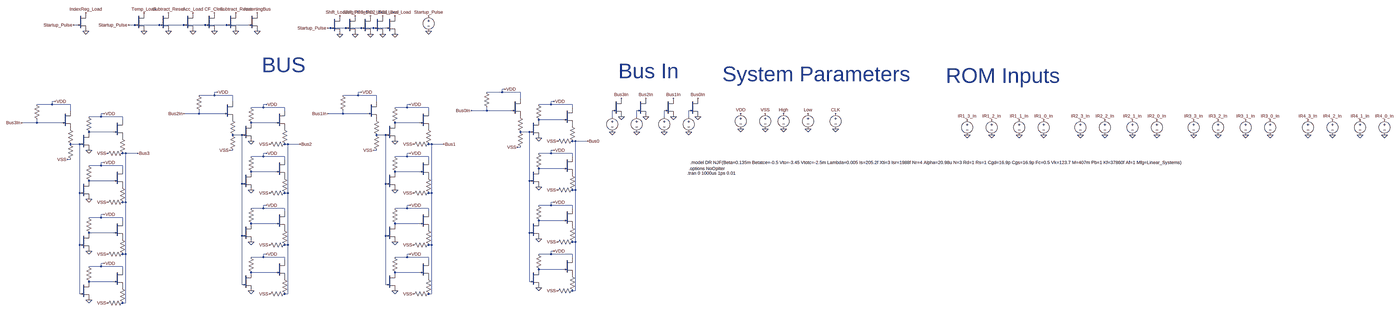
[diagram p0: schematic controls.asc, whole sheet]
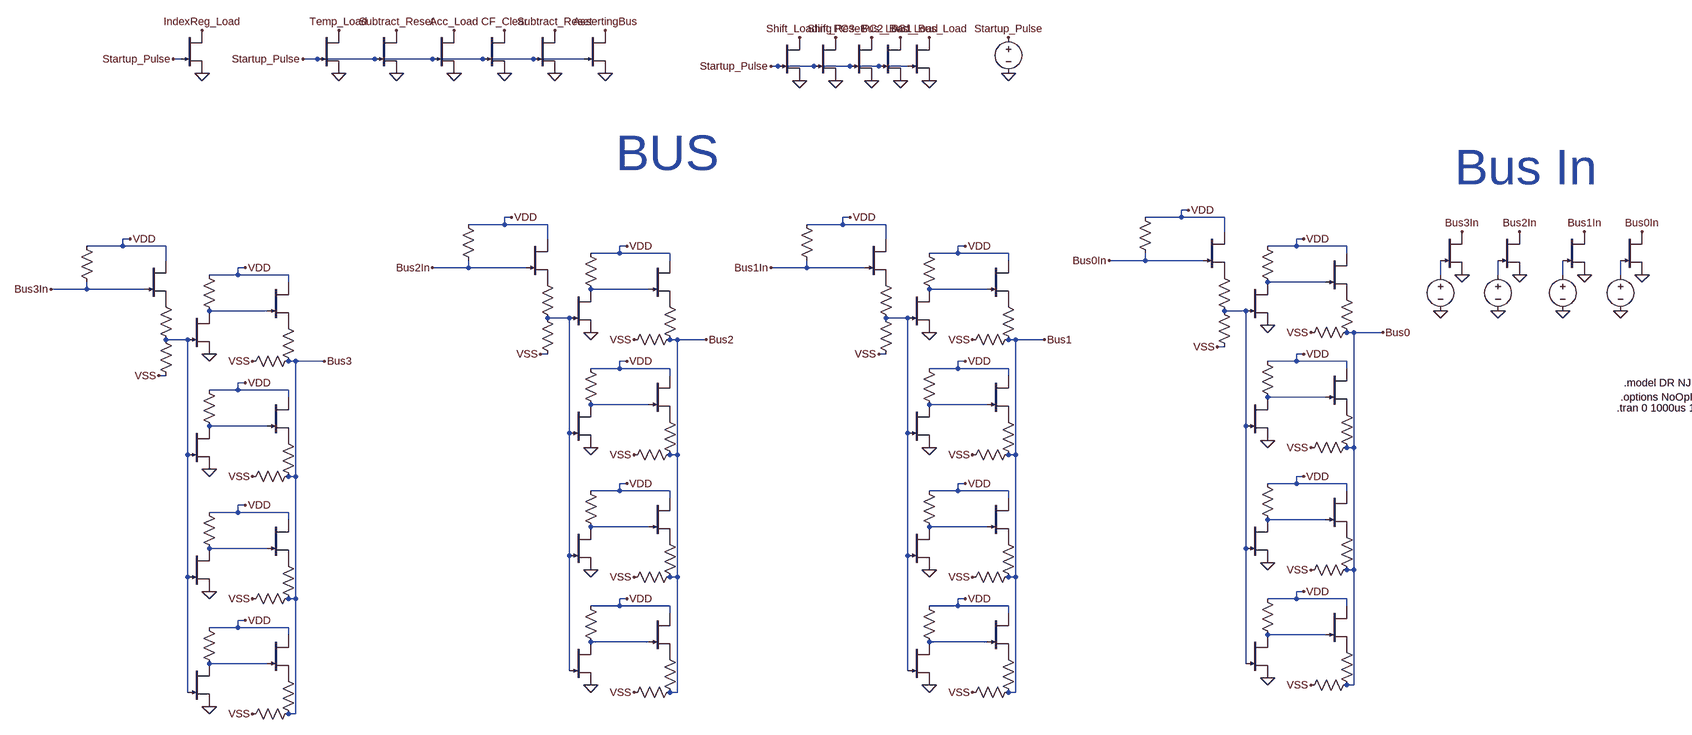
[diagram p1: schematic controls.asc, part, row 1 of 1, column 1 of 2]
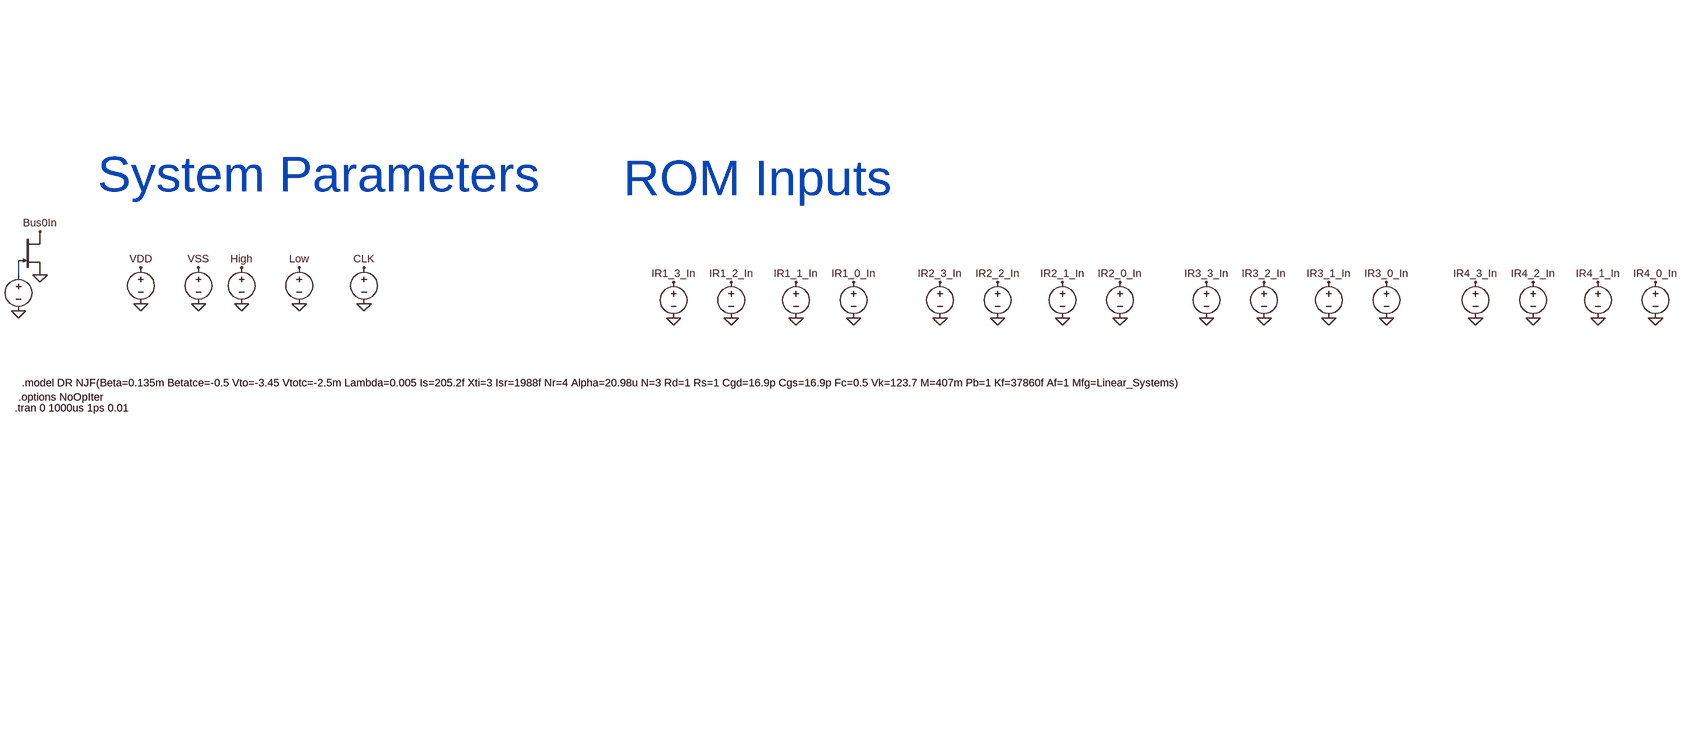
[diagram p2: schematic controls.asc, part, row 1 of 1, column 2 of 2]
controls.asc, the LTspice schematic file:
Version 4.1
SHEET 1 109444 42780
WIRE 5360 -10224 5344 -10224
WIRE 5664 -10224 5632 -10224
WIRE 5792 -10224 5664 -10224
WIRE 5920 -10224 5792 -10224
WIRE 6032 -10224 5920 -10224
WIRE 6144 -10224 6032 -10224
WIRE 6256 -10224 6144 -10224
WIRE 6688 -10208 6672 -10208
WIRE 6768 -10208 6688 -10208
WIRE 6848 -10208 6768 -10208
WIRE 6912 -10208 6848 -10208
WIRE 6976 -10208 6912 -10208
WIRE 7600 -9888 7584 -9888
WIRE 6096 -9872 6080 -9872
WIRE 6848 -9872 6832 -9872
WIRE 7584 -9872 7584 -9888
WIRE 7584 -9872 7504 -9872
WIRE 7680 -9872 7584 -9872
WIRE 6080 -9856 6080 -9872
WIRE 6080 -9856 6000 -9856
WIRE 6176 -9856 6080 -9856
WIRE 6832 -9856 6832 -9872
WIRE 6832 -9856 6752 -9856
WIRE 6928 -9856 6832 -9856
WIRE 7680 -9840 7680 -9872
WIRE 5248 -9824 5232 -9824
WIRE 6176 -9824 6176 -9856
WIRE 6928 -9824 6928 -9856
WIRE 7856 -9824 7840 -9824
WIRE 5232 -9808 5232 -9824
WIRE 5232 -9808 5152 -9808
WIRE 5328 -9808 5232 -9808
WIRE 6352 -9808 6336 -9808
WIRE 7104 -9808 7088 -9808
WIRE 7840 -9808 7840 -9824
WIRE 7840 -9808 7776 -9808
WIRE 7952 -9808 7840 -9808
WIRE 6336 -9792 6336 -9808
WIRE 6336 -9792 6272 -9792
WIRE 6448 -9792 6336 -9792
WIRE 7088 -9792 7088 -9808
WIRE 7088 -9792 7024 -9792
WIRE 7200 -9792 7088 -9792
WIRE 7952 -9792 7952 -9808
WIRE 5328 -9776 5328 -9808
WIRE 6448 -9776 6448 -9792
WIRE 7200 -9776 7200 -9792
WIRE 7504 -9776 7504 -9792
WIRE 7504 -9776 7424 -9776
WIRE 7632 -9776 7504 -9776
WIRE 5504 -9760 5488 -9760
WIRE 6000 -9760 6000 -9776
WIRE 6000 -9760 5920 -9760
WIRE 6128 -9760 6000 -9760
WIRE 6752 -9760 6752 -9776
WIRE 6752 -9760 6672 -9760
WIRE 6880 -9760 6752 -9760
WIRE 5488 -9744 5488 -9760
WIRE 5488 -9744 5424 -9744
WIRE 5600 -9744 5488 -9744
WIRE 8160 -9744 8160 -9776
WIRE 8288 -9744 8288 -9776
WIRE 8432 -9744 8432 -9776
WIRE 8560 -9744 8560 -9776
WIRE 5600 -9728 5600 -9744
WIRE 7904 -9728 7776 -9728
WIRE 5152 -9712 5152 -9728
WIRE 5152 -9712 5072 -9712
WIRE 5280 -9712 5152 -9712
WIRE 6400 -9712 6272 -9712
WIRE 7152 -9712 7024 -9712
WIRE 5552 -9664 5424 -9664
WIRE 7728 -9664 7680 -9664
WIRE 6224 -9648 6176 -9648
WIRE 6976 -9648 6928 -9648
WIRE 7968 -9616 7952 -9616
WIRE 8032 -9616 7968 -9616
WIRE 5376 -9600 5328 -9600
WIRE 6464 -9600 6448 -9600
WIRE 6528 -9600 6464 -9600
WIRE 7216 -9600 7200 -9600
WIRE 7280 -9600 7216 -9600
WIRE 7680 -9584 7664 -9584
WIRE 6176 -9568 6160 -9568
WIRE 6928 -9568 6912 -9568
WIRE 7856 -9568 7840 -9568
WIRE 5616 -9552 5600 -9552
WIRE 5680 -9552 5616 -9552
WIRE 6352 -9552 6336 -9552
WIRE 7104 -9552 7088 -9552
WIRE 7840 -9552 7840 -9568
WIRE 7840 -9552 7776 -9552
WIRE 7952 -9552 7840 -9552
WIRE 6336 -9536 6336 -9552
WIRE 6336 -9536 6272 -9536
WIRE 6448 -9536 6336 -9536
WIRE 7088 -9536 7088 -9552
WIRE 7088 -9536 7024 -9536
WIRE 7200 -9536 7088 -9536
WIRE 7952 -9536 7952 -9552
WIRE 5328 -9520 5312 -9520
WIRE 6448 -9520 6448 -9536
WIRE 7200 -9520 7200 -9536
WIRE 5504 -9504 5488 -9504
WIRE 5488 -9488 5488 -9504
WIRE 5488 -9488 5424 -9488
WIRE 5600 -9488 5488 -9488
WIRE 5600 -9472 5600 -9488
WIRE 7904 -9472 7776 -9472
WIRE 6400 -9456 6272 -9456
WIRE 7152 -9456 7024 -9456
WIRE 5552 -9408 5424 -9408
WIRE 7728 -9408 7728 -9664
WIRE 6224 -9392 6224 -9648
WIRE 6976 -9392 6976 -9648
WIRE 7968 -9360 7968 -9616
WIRE 7968 -9360 7952 -9360
WIRE 5376 -9344 5376 -9600
WIRE 6464 -9344 6464 -9600
WIRE 6464 -9344 6448 -9344
WIRE 7216 -9344 7216 -9600
WIRE 7216 -9344 7200 -9344
WIRE 5616 -9296 5616 -9552
WIRE 5616 -9296 5600 -9296
WIRE 7856 -9296 7840 -9296
WIRE 6352 -9280 6336 -9280
WIRE 7104 -9280 7088 -9280
WIRE 7840 -9280 7840 -9296
WIRE 7840 -9280 7776 -9280
WIRE 7952 -9280 7840 -9280
WIRE 6336 -9264 6336 -9280
WIRE 6336 -9264 6272 -9264
WIRE 6448 -9264 6336 -9264
WIRE 7088 -9264 7088 -9280
WIRE 7088 -9264 7024 -9264
WIRE 7200 -9264 7088 -9264
WIRE 7952 -9264 7952 -9280
WIRE 6448 -9248 6448 -9264
WIRE 7200 -9248 7200 -9264
WIRE 5504 -9232 5488 -9232
WIRE 5488 -9216 5488 -9232
WIRE 5488 -9216 5424 -9216
WIRE 5600 -9216 5488 -9216
WIRE 5600 -9200 5600 -9216
WIRE 7904 -9200 7776 -9200
WIRE 6400 -9184 6272 -9184
WIRE 7152 -9184 7024 -9184
WIRE 5552 -9136 5424 -9136
WIRE 7728 -9136 7728 -9408
WIRE 6224 -9120 6224 -9392
WIRE 6976 -9120 6976 -9392
WIRE 7968 -9088 7968 -9360
WIRE 7968 -9088 7952 -9088
WIRE 5376 -9072 5376 -9344
WIRE 6464 -9072 6464 -9344
WIRE 6464 -9072 6448 -9072
WIRE 7216 -9072 7216 -9344
WIRE 7216 -9072 7200 -9072
WIRE 7856 -9040 7840 -9040
WIRE 5616 -9024 5616 -9296
WIRE 5616 -9024 5600 -9024
WIRE 6352 -9024 6336 -9024
WIRE 7104 -9024 7088 -9024
WIRE 7840 -9024 7840 -9040
WIRE 7840 -9024 7776 -9024
WIRE 7952 -9024 7840 -9024
WIRE 6336 -9008 6336 -9024
WIRE 6336 -9008 6272 -9008
WIRE 6448 -9008 6336 -9008
WIRE 7088 -9008 7088 -9024
WIRE 7088 -9008 7024 -9008
WIRE 7200 -9008 7088 -9008
WIRE 7952 -9008 7952 -9024
WIRE 6448 -8992 6448 -9008
WIRE 7200 -8992 7200 -9008
WIRE 5504 -8976 5488 -8976
WIRE 5488 -8960 5488 -8976
WIRE 5488 -8960 5424 -8960
WIRE 5600 -8960 5488 -8960
WIRE 5600 -8944 5600 -8960
WIRE 7904 -8944 7776 -8944
WIRE 6400 -8928 6272 -8928
WIRE 7152 -8928 7024 -8928
WIRE 5552 -8880 5424 -8880
WIRE 7728 -8880 7728 -9136
WIRE 6224 -8864 6224 -9120
WIRE 6976 -8864 6976 -9120
WIRE 7968 -8832 7968 -9088
WIRE 7968 -8832 7952 -8832
WIRE 5376 -8816 5376 -9072
WIRE 6464 -8816 6464 -9072
WIRE 6464 -8816 6448 -8816
WIRE 7216 -8816 7216 -9072
WIRE 7216 -8816 7200 -8816
WIRE 5616 -8768 5616 -9024
WIRE 5616 -8768 5600 -8768
FLAG 8960 -9680 0
FLAG 8832 -9760 VDD
FLAG 8832 -9680 0
FLAG 8960 -9760 VSS
FLAG 9056 -9680 0
FLAG 9056 -9760 High
FLAG 9184 -9680 0
FLAG 9184 -9760 Low
FLAG 9328 -9680 0
FLAG 9328 -9760 CLK
FLAG 10016 -9648 0
FLAG 10144 -9648 0
FLAG 10288 -9648 0
FLAG 10416 -9648 0
FLAG 6528 -9600 Bus2
FLAG 7280 -9600 Bus1
FLAG 8032 -9616 Bus0
FLAG 5920 -9760 Bus2In
FLAG 6672 -9760 Bus1In
FLAG 7424 -9776 Bus0In
FLAG 10016 -9728 IR1_3_In
FLAG 10144 -9728 IR1_2_In
FLAG 10288 -9728 IR1_1_In
FLAG 10416 -9728 IR1_0_In
FLAG 10608 -9648 0
FLAG 10736 -9648 0
FLAG 10880 -9648 0
FLAG 11008 -9648 0
FLAG 10608 -9728 IR2_3_In
FLAG 10736 -9728 IR2_2_In
FLAG 10880 -9728 IR2_1_In
FLAG 11008 -9728 IR2_0_In
FLAG 11200 -9648 0
FLAG 11328 -9648 0
FLAG 11472 -9648 0
FLAG 11600 -9648 0
FLAG 11200 -9728 IR3_3_In
FLAG 11328 -9728 IR3_2_In
FLAG 11472 -9728 IR3_1_In
FLAG 11600 -9728 IR3_0_In
FLAG 11808 -9648 0
FLAG 11936 -9648 0
FLAG 12080 -9648 0
FLAG 12208 -9648 0
FLAG 11808 -9728 IR4_3_In
FLAG 11936 -9728 IR4_2_In
FLAG 12080 -9728 IR4_1_In
FLAG 12208 -9728 IR4_0_In
FLAG 5632 -10224 Startup_Pulse
FLAG 5712 -10288 Temp_Load
FLAG 5968 -10288 Acc_Load
FLAG 6080 -10288 CF_Clear
FLAG 5840 -10288 Subtract_Reset
FLAG 5968 -10192 0
FLAG 5712 -10192 0
FLAG 6080 -10192 0
FLAG 5840 -10192 0
FLAG 6192 -10288 Subtract_Reset
FLAG 6192 -10192 0
FLAG 6304 -10288 AssertingBus
FLAG 6304 -10192 0
FLAG 6672 -10208 Startup_Pulse
FLAG 6736 -10176 0
FLAG 6736 -10272 Shift_Loading
FLAG 6816 -10176 0
FLAG 6816 -10272 Shift_Reset
FLAG 5408 -10288 IndexReg_Load
FLAG 5344 -10224 Startup_Pulse
FLAG 5408 -10192 0
FLAG 7024 -10272 PC1_Bus_Load
FLAG 6960 -10272 PC2_Bus_Load
FLAG 6896 -10272 PC3_Bus_Load
FLAG 6896 -10176 0
FLAG 6960 -10176 0
FLAG 7024 -10176 0
FLAG 7200 -10272 Startup_Pulse
FLAG 7200 -10192 0
FLAG 8160 -9664 0
FLAG 8288 -9664 0
FLAG 8432 -9664 0
FLAG 8560 -9664 0
FLAG 8608 -9840 Bus0In
FLAG 8208 -9744 0
FLAG 8336 -9744 0
FLAG 8480 -9744 0
FLAG 8608 -9744 0
FLAG 8480 -9840 Bus1In
FLAG 8336 -9840 Bus2In
FLAG 8208 -9840 Bus3In
FLAG 5424 -9568 0
FLAG 5248 -9824 VDD
FLAG 5504 -9760 VDD
FLAG 5312 -9520 VSS
FLAG 5520 -9552 VSS
FLAG 5680 -9552 Bus3
FLAG 5072 -9712 Bus3In
FLAG 5424 -9312 0
FLAG 5504 -9504 VDD
FLAG 5520 -9296 VSS
FLAG 5424 -9040 0
FLAG 5504 -9232 VDD
FLAG 5520 -9024 VSS
FLAG 5424 -8784 0
FLAG 5504 -8976 VDD
FLAG 5520 -8768 VSS
FLAG 6272 -9616 0
FLAG 6096 -9872 VDD
FLAG 6352 -9808 VDD
FLAG 6160 -9568 VSS
FLAG 6368 -9600 VSS
FLAG 6272 -9360 0
FLAG 6352 -9552 VDD
FLAG 6368 -9344 VSS
FLAG 6272 -9088 0
FLAG 6352 -9280 VDD
FLAG 6368 -9072 VSS
FLAG 6272 -8832 0
FLAG 6352 -9024 VDD
FLAG 6368 -8816 VSS
FLAG 7024 -9616 0
FLAG 6848 -9872 VDD
FLAG 7104 -9808 VDD
FLAG 6912 -9568 VSS
FLAG 7120 -9600 VSS
FLAG 7024 -9360 0
FLAG 7104 -9552 VDD
FLAG 7120 -9344 VSS
FLAG 7024 -9088 0
FLAG 7104 -9280 VDD
FLAG 7120 -9072 VSS
FLAG 7024 -8832 0
FLAG 7104 -9024 VDD
FLAG 7120 -8816 VSS
FLAG 7776 -9632 0
FLAG 7600 -9888 VDD
FLAG 7856 -9824 VDD
FLAG 7664 -9584 VSS
FLAG 7872 -9616 VSS
FLAG 7776 -9376 0
FLAG 7856 -9568 VDD
FLAG 7872 -9360 VSS
FLAG 7776 -9104 0
FLAG 7856 -9296 VDD
FLAG 7872 -9088 VSS
FLAG 7776 -8848 0
FLAG 7856 -9040 VDD
FLAG 7872 -8832 VSS
SYMBOL voltage 8832 -9776 R0
WINDOW 0 48 34 Invisible 2
WINDOW 3 53 69 Invisible 2
WINDOW 123 0 0 Left 0
WINDOW 39 0 0 Left 0
SYMATTR InstName V4
SYMATTR Value 24
SYMBOL voltage 8960 -9776 R0
WINDOW 123 0 0 Left 0
WINDOW 39 0 0 Left 0
WINDOW 0 37 46 Invisible 2
WINDOW 3 43 75 Invisible 2
SYMATTR InstName V5
SYMATTR Value -20
SYMBOL voltage 9056 -9776 R0
WINDOW 123 0 0 Left 0
WINDOW 39 0 0 Left 0
WINDOW 0 39 38 Invisible 2
WINDOW 3 43 75 Invisible 2
SYMATTR InstName V7
SYMATTR Value PULSE(-3.6 -800m 11u 1ns 1ns 50 50 1)
SYMBOL voltage 9184 -9776 R0
WINDOW 3 24 96 Invisible 2
WINDOW 123 0 0 Left 0
WINDOW 39 0 0 Left 0
WINDOW 0 24 16 Invisible 2
SYMATTR Value PULSE(-800m -3.6 0 1n 1n 50 50 1)
SYMATTR InstName V10
SYMBOL voltage 9328 -9776 R0
WINDOW 123 0 0 Left 0
WINDOW 39 0 0 Left 0
WINDOW 0 39 38 Invisible 2
WINDOW 3 43 75 Invisible 2
SYMATTR InstName V3
SYMATTR Value PULSE(-3.6 -800m 10u 1ns 1ns 5us 10us 10000000000000)
SYMBOL voltage 10016 -9744 R0
WINDOW 0 56 32 Invisible 2
WINDOW 3 56 72 Invisible 2
SYMATTR InstName V_D1
SYMATTR Value PWL file=ir1_3_in.pwl
SYMBOL voltage 10144 -9744 R0
WINDOW 0 56 32 Invisible 2
WINDOW 3 56 72 Invisible 2
WINDOW 123 0 0 Left 0
WINDOW 39 0 0 Left 0
SYMATTR InstName V_D5
SYMATTR Value PWL file=ir1_2_in.pwl
SYMBOL voltage 10288 -9744 R0
WINDOW 0 56 32 Invisible 2
WINDOW 3 56 72 Invisible 2
WINDOW 123 0 0 Left 0
WINDOW 39 0 0 Left 0
SYMATTR InstName V_D2
SYMATTR Value PWL file=ir1_1_in.pwl
SYMBOL voltage 10416 -9744 R0
WINDOW 0 56 32 Invisible 2
WINDOW 3 56 72 Invisible 2
WINDOW 123 0 0 Left 0
WINDOW 39 0 0 Left 0
SYMATTR InstName V_D6
SYMATTR Value PWL file=ir1_0_in.pwl
SYMBOL voltage 10608 -9744 R0
WINDOW 0 56 32 Invisible 2
WINDOW 3 56 72 Invisible 2
SYMATTR InstName V_D3
SYMATTR Value PWL file=ir2_3_in.pwl
SYMBOL voltage 10736 -9744 R0
WINDOW 0 56 32 Invisible 2
WINDOW 3 56 72 Invisible 2
WINDOW 123 0 0 Left 0
WINDOW 39 0 0 Left 0
SYMATTR InstName V_D4
SYMATTR Value PWL file=ir2_2_in.pwl
SYMBOL voltage 10880 -9744 R0
WINDOW 0 56 32 Invisible 2
WINDOW 3 56 72 Invisible 2
WINDOW 123 0 0 Left 0
WINDOW 39 0 0 Left 0
SYMATTR InstName V_D7
SYMATTR Value PWL file=ir2_1_in.pwl
SYMBOL voltage 11008 -9744 R0
WINDOW 0 56 32 Invisible 2
WINDOW 3 56 72 Invisible 2
WINDOW 123 0 0 Left 0
WINDOW 39 0 0 Left 0
SYMATTR InstName V_D8
SYMATTR Value PWL file=ir2_0_in.pwl
SYMBOL voltage 11200 -9744 R0
WINDOW 0 56 32 Invisible 2
WINDOW 3 56 72 Invisible 2
SYMATTR InstName V_D9
SYMATTR Value PWL file=ir3_3_in.pwl
SYMBOL voltage 11328 -9744 R0
WINDOW 0 56 32 Invisible 2
WINDOW 3 56 72 Invisible 2
WINDOW 123 0 0 Left 0
WINDOW 39 0 0 Left 0
SYMATTR InstName V_D10
SYMATTR Value PWL file=ir3_2_in.pwl
SYMBOL voltage 11472 -9744 R0
WINDOW 0 56 32 Invisible 2
WINDOW 3 56 72 Invisible 2
WINDOW 123 0 0 Left 0
WINDOW 39 0 0 Left 0
SYMATTR InstName V_D11
SYMATTR Value PWL file=ir3_1_in.pwl
SYMBOL voltage 11600 -9744 R0
WINDOW 0 56 32 Invisible 2
WINDOW 3 56 72 Invisible 2
WINDOW 123 0 0 Left 0
WINDOW 39 0 0 Left 0
SYMATTR InstName V_D12
SYMATTR Value PWL file=ir3_0_in.pwl
SYMBOL voltage 11808 -9744 R0
WINDOW 0 56 32 Invisible 2
WINDOW 3 56 72 Invisible 2
SYMATTR InstName V_D13
SYMATTR Value PWL file=ir4_3_in.pwl
SYMBOL voltage 11936 -9744 R0
WINDOW 0 56 32 Invisible 2
WINDOW 3 56 72 Invisible 2
WINDOW 123 0 0 Left 0
WINDOW 39 0 0 Left 0
SYMATTR InstName V_D14
SYMATTR Value PWL file=ir4_2_in.pwl
SYMBOL voltage 12080 -9744 R0
WINDOW 0 56 32 Invisible 2
WINDOW 3 56 72 Invisible 2
WINDOW 123 0 0 Left 0
WINDOW 39 0 0 Left 0
SYMATTR InstName V_D15
SYMATTR Value PWL file=ir4_1_in.pwl
SYMBOL voltage 12208 -9744 R0
WINDOW 0 56 32 Invisible 2
WINDOW 3 56 72 Invisible 2
WINDOW 123 0 0 Left 0
WINDOW 39 0 0 Left 0
SYMATTR InstName V_D16
SYMATTR Value PWL file=ir4_0_in.pwl
SYMBOL njf 5920 -10288 R0
WINDOW 0 19 44 Invisible 2
WINDOW 3 28 43 Invisible 2
SYMATTR InstName J_A1
SYMATTR Value DR
SYMBOL njf 5664 -10288 R0
WINDOW 0 27 42 Invisible 2
WINDOW 3 31 43 Invisible 2
SYMATTR InstName J_A2
SYMATTR Value DR
SYMBOL njf 6032 -10288 R0
WINDOW 0 20 138 Invisible 2
WINDOW 3 32 144 Invisible 2
SYMATTR InstName J_A3
SYMATTR Value DR
SYMBOL njf 5792 -10288 R0
WINDOW 0 25 44 Invisible 2
WINDOW 3 29 48 Invisible 2
SYMATTR InstName J_A4
SYMATTR Value DR
SYMBOL njf 6144 -10288 R0
WINDOW 0 21 40 Invisible 2
WINDOW 3 31 44 Invisible 2
SYMATTR InstName J_A69
SYMATTR Value DR
SYMBOL njf 6256 -10288 R0
WINDOW 0 31 41 Invisible 2
WINDOW 3 26 43 Invisible 2
SYMATTR InstName J_A70
SYMATTR Value DR
SYMBOL njf 6688 -10272 R0
WINDOW 0 31 155 Invisible 2
WINDOW 3 61 170 Invisible 2
SYMATTR InstName J_B1
SYMATTR Value DR
SYMBOL njf 6768 -10272 R0
WINDOW 0 -41 157 Invisible 2
WINDOW 3 -11 163 Invisible 2
SYMATTR InstName J_B2
SYMATTR Value DR
SYMBOL njf 5360 -10288 R0
WINDOW 0 27 44 Invisible 2
WINDOW 3 28 43 Invisible 2
SYMATTR InstName J_A71
SYMATTR Value DR
SYMBOL njf 6848 -10272 R0
WINDOW 0 -121 172 Invisible 2
WINDOW 3 -84 167 Invisible 2
SYMATTR InstName J_A72
SYMATTR Value DR
SYMBOL njf 6912 -10272 R0
WINDOW 0 -189 164 Invisible 2
WINDOW 3 -151 161 Invisible 2
SYMATTR InstName J_A73
SYMATTR Value DR
SYMBOL njf 6976 -10272 R0
WINDOW 0 -232 156 Invisible 2
WINDOW 3 -205 155 Invisible 2
SYMATTR InstName J_A74
SYMATTR Value DR
SYMBOL voltage 7200 -10288 R0
WINDOW 123 0 0 Left 0
WINDOW 39 0 0 Left 0
WINDOW 0 39 38 Invisible 2
WINDOW 3 43 75 Invisible 2
SYMATTR InstName V1
SYMATTR Value PULSE(-3.6 -800m 6u 1ns 1ns 9us 10us 1)
SYMBOL voltage 8160 -9760 R0
WINDOW 0 56 32 Invisible 2
WINDOW 3 56 72 Invisible 2
SYMATTR InstName V_D17
SYMATTR Value PWL file=bus3in.pwl
SYMBOL voltage 8288 -9760 R0
WINDOW 0 56 32 Invisible 2
WINDOW 3 56 72 Invisible 2
WINDOW 123 0 0 Left 0
WINDOW 39 0 0 Left 0
SYMATTR InstName V_D18
SYMATTR Value PWL file=bus2in.pwl
SYMBOL voltage 8432 -9760 R0
WINDOW 0 56 32 Invisible 2
WINDOW 3 56 72 Invisible 2
WINDOW 123 0 0 Left 0
WINDOW 39 0 0 Left 0
SYMATTR InstName V_D19
SYMATTR Value PWL file=bus1in.pwl
SYMBOL voltage 8560 -9760 R0
WINDOW 0 56 32 Invisible 2
WINDOW 3 56 72 Invisible 2
WINDOW 123 0 0 Left 0
WINDOW 39 0 0 Left 0
SYMATTR InstName V_D20
SYMATTR Value PWL file=bus0in.pwl
SYMBOL njf 8160 -9840 R0
WINDOW 0 -232 156 Invisible 2
WINDOW 3 -205 155 Invisible 2
SYMATTR InstName J_A75
SYMATTR Value DR
SYMBOL njf 8288 -9840 R0
WINDOW 0 -232 156 Invisible 2
WINDOW 3 -205 155 Invisible 2
SYMATTR InstName J_A76
SYMATTR Value DR
SYMBOL njf 8432 -9840 R0
WINDOW 0 -232 156 Invisible 2
WINDOW 3 -205 155 Invisible 2
SYMATTR InstName J_A77
SYMATTR Value DR
SYMBOL njf 8560 -9840 R0
WINDOW 0 -232 156 Invisible 2
WINDOW 3 -205 155 Invisible 2
SYMATTR InstName J_A78
SYMATTR Value DR
SYMBOL res 5136 -9824 R0
WINDOW 0 -35 57 Invisible 2
WINDOW 3 34 56 Invisible 2
SYMATTR InstName R126
SYMATTR Value 100k
SYMBOL njf 5280 -9776 R0
WINDOW 0 56 32 Invisible 2
WINDOW 3 56 72 Invisible 2
SYMATTR InstName J_F1
SYMATTR Value DR
SYMBOL res 5312 -9696 R0
WINDOW 0 -24 60 Invisible 2
WINDOW 3 34 58 Invisible 2
SYMATTR InstName R127
SYMATTR Value 1k
SYMBOL res 5312 -9616 R0
WINDOW 0 -22 62 Invisible 2
WINDOW 3 37 62 Invisible 2
SYMATTR InstName R128
SYMATTR Value 4.8k
SYMBOL njf 5376 -9664 R0
WINDOW 0 56 32 Invisible 2
WINDOW 3 56 72 Invisible 2
SYMATTR InstName J_A86
SYMATTR Value DR
SYMBOL res 5408 -9760 R0
WINDOW 0 56 32 Invisible 2
WINDOW 3 56 72 Invisible 2
SYMATTR InstName R129
SYMATTR Value 50k
SYMBOL njf 5552 -9728 R0
WINDOW 0 56 32 Invisible 2
WINDOW 3 56 72 Invisible 2
SYMATTR InstName J_A87
SYMATTR Value DR
SYMBOL res 5584 -9648 R0
WINDOW 0 37 24 Invisible 2
WINDOW 3 -30 25 Invisible 2
SYMATTR InstName R130
SYMATTR Value 1k
SYMBOL res 5616 -9568 R90
WINDOW 0 59 66 Invisible 2
WINDOW 3 34 13 Invisible 2
SYMATTR InstName R131
SYMATTR Value 4.5k
SYMBOL njf 5376 -9408 R0
WINDOW 0 56 32 Invisible 2
WINDOW 3 56 72 Invisible 2
SYMATTR InstName J_A88
SYMATTR Value DR
SYMBOL res 5408 -9504 R0
WINDOW 0 56 32 Invisible 2
WINDOW 3 56 72 Invisible 2
SYMATTR InstName R132
SYMATTR Value 50k
SYMBOL njf 5552 -9472 R0
WINDOW 0 56 32 Invisible 2
WINDOW 3 56 72 Invisible 2
SYMATTR InstName J_A89
SYMATTR Value DR
SYMBOL res 5584 -9392 R0
WINDOW 0 37 24 Invisible 2
WINDOW 3 -30 25 Invisible 2
SYMATTR InstName R133
SYMATTR Value 1k
SYMBOL res 5616 -9312 R90
WINDOW 0 59 66 Invisible 2
WINDOW 3 34 13 Invisible 2
SYMATTR InstName R134
SYMATTR Value 4.5k
SYMBOL njf 5376 -9136 R0
WINDOW 0 56 32 Invisible 2
WINDOW 3 56 72 Invisible 2
SYMATTR InstName J_A90
SYMATTR Value DR
SYMBOL res 5408 -9232 R0
WINDOW 0 56 32 Invisible 2
WINDOW 3 56 72 Invisible 2
SYMATTR InstName R135
SYMATTR Value 50k
SYMBOL njf 5552 -9200 R0
WINDOW 0 56 32 Invisible 2
WINDOW 3 56 72 Invisible 2
SYMATTR InstName J_A91
SYMATTR Value DR
SYMBOL res 5584 -9120 R0
WINDOW 0 37 24 Invisible 2
WINDOW 3 -30 25 Invisible 2
SYMATTR InstName R136
SYMATTR Value 1k
SYMBOL res 5616 -9040 R90
WINDOW 0 59 66 Invisible 2
WINDOW 3 34 13 Invisible 2
SYMATTR InstName R137
SYMATTR Value 4.5k
SYMBOL njf 5376 -8880 R0
WINDOW 0 56 32 Invisible 2
WINDOW 3 56 72 Invisible 2
SYMATTR InstName J_A92
SYMATTR Value DR
SYMBOL res 5408 -8976 R0
WINDOW 0 56 32 Invisible 2
WINDOW 3 56 72 Invisible 2
SYMATTR InstName R138
SYMATTR Value 50k
SYMBOL njf 5552 -8944 R0
WINDOW 0 56 32 Invisible 2
WINDOW 3 56 72 Invisible 2
SYMATTR InstName J_A93
SYMATTR Value DR
SYMBOL res 5584 -8864 R0
WINDOW 0 37 24 Invisible 2
WINDOW 3 -30 25 Invisible 2
SYMATTR InstName R139
SYMATTR Value 1k
SYMBOL res 5616 -8784 R90
WINDOW 0 59 66 Invisible 2
WINDOW 3 34 13 Invisible 2
SYMATTR InstName R140
SYMATTR Value 4.5k
SYMBOL res 5984 -9872 R0
WINDOW 0 -35 57 Invisible 2
WINDOW 3 34 56 Invisible 2
SYMATTR InstName R16
SYMATTR Value 100k
SYMBOL njf 6128 -9824 R0
WINDOW 0 56 32 Invisible 2
WINDOW 3 56 72 Invisible 2
SYMATTR InstName J_F3
SYMATTR Value DR
SYMBOL res 6160 -9744 R0
WINDOW 0 -24 60 Invisible 2
WINDOW 3 34 58 Invisible 2
SYMATTR InstName R17
SYMATTR Value 1k
SYMBOL res 6160 -9664 R0
WINDOW 0 -22 62 Invisible 2
WINDOW 3 37 62 Invisible 2
SYMATTR InstName R18
SYMATTR Value 4.8k
SYMBOL njf 6224 -9712 R0
WINDOW 0 56 32 Invisible 2
WINDOW 3 56 72 Invisible 2
SYMATTR InstName J_A13
SYMATTR Value DR
SYMBOL res 6256 -9808 R0
WINDOW 0 56 32 Invisible 2
WINDOW 3 56 72 Invisible 2
SYMATTR InstName R19
SYMATTR Value 50k
SYMBOL njf 6400 -9776 R0
WINDOW 0 56 32 Invisible 2
WINDOW 3 56 72 Invisible 2
SYMATTR InstName J_A14
SYMATTR Value DR
SYMBOL res 6432 -9696 R0
WINDOW 0 37 24 Invisible 2
WINDOW 3 -30 25 Invisible 2
SYMATTR InstName R20
SYMATTR Value 1k
SYMBOL res 6464 -9616 R90
WINDOW 0 59 66 Invisible 2
WINDOW 3 34 13 Invisible 2
SYMATTR InstName R21
SYMATTR Value 4.5k
SYMBOL njf 6224 -9456 R0
WINDOW 0 56 32 Invisible 2
WINDOW 3 56 72 Invisible 2
SYMATTR InstName J_A15
SYMATTR Value DR
SYMBOL res 6256 -9552 R0
WINDOW 0 56 32 Invisible 2
WINDOW 3 56 72 Invisible 2
SYMATTR InstName R22
SYMATTR Value 50k
SYMBOL njf 6400 -9520 R0
WINDOW 0 56 32 Invisible 2
WINDOW 3 56 72 Invisible 2
SYMATTR InstName J_A16
SYMATTR Value DR
SYMBOL res 6432 -9440 R0
WINDOW 0 37 24 Invisible 2
WINDOW 3 -30 25 Invisible 2
SYMATTR InstName R23
SYMATTR Value 1k
SYMBOL res 6464 -9360 R90
WINDOW 0 59 66 Invisible 2
WINDOW 3 34 13 Invisible 2
SYMATTR InstName R24
SYMATTR Value 4.5k
SYMBOL njf 6224 -9184 R0
WINDOW 0 56 32 Invisible 2
WINDOW 3 56 72 Invisible 2
SYMATTR InstName J_A17
SYMATTR Value DR
SYMBOL res 6256 -9280 R0
WINDOW 0 56 32 Invisible 2
WINDOW 3 56 72 Invisible 2
SYMATTR InstName R25
SYMATTR Value 50k
SYMBOL njf 6400 -9248 R0
WINDOW 0 56 32 Invisible 2
WINDOW 3 56 72 Invisible 2
SYMATTR InstName J_A18
SYMATTR Value DR
SYMBOL res 6432 -9168 R0
WINDOW 0 37 24 Invisible 2
WINDOW 3 -30 25 Invisible 2
SYMATTR InstName R26
SYMATTR Value 1k
SYMBOL res 6464 -9088 R90
WINDOW 0 59 66 Invisible 2
WINDOW 3 34 13 Invisible 2
SYMATTR InstName R27
SYMATTR Value 4.5k
SYMBOL njf 6224 -8928 R0
WINDOW 0 56 32 Invisible 2
WINDOW 3 56 72 Invisible 2
SYMATTR InstName J_A19
SYMATTR Value DR
SYMBOL res 6256 -9024 R0
WINDOW 0 56 32 Invisible 2
WINDOW 3 56 72 Invisible 2
SYMATTR InstName R28
SYMATTR Value 50k
SYMBOL njf 6400 -8992 R0
WINDOW 0 56 32 Invisible 2
WINDOW 3 56 72 Invisible 2
SYMATTR InstName J_A20
SYMATTR Value DR
SYMBOL res 6432 -8912 R0
WINDOW 0 37 24 Invisible 2
WINDOW 3 -30 25 Invisible 2
SYMATTR InstName R29
SYMATTR Value 1k
SYMBOL res 6464 -8832 R90
WINDOW 0 59 66 Invisible 2
WINDOW 3 34 13 Invisible 2
SYMATTR InstName R30
SYMATTR Value 4.5k
SYMBOL res 6736 -9872 R0
WINDOW 0 -35 57 Invisible 2
WINDOW 3 34 56 Invisible 2
SYMATTR InstName R31
SYMATTR Value 100k
SYMBOL njf 6880 -9824 R0
WINDOW 0 56 32 Invisible 2
WINDOW 3 56 72 Invisible 2
SYMATTR InstName J_F4
SYMATTR Value DR
SYMBOL res 6912 -9744 R0
WINDOW 0 -24 60 Invisible 2
WINDOW 3 34 58 Invisible 2
SYMATTR InstName R32
SYMATTR Value 1k
SYMBOL res 6912 -9664 R0
WINDOW 0 -22 62 Invisible 2
WINDOW 3 37 62 Invisible 2
SYMATTR InstName R33
SYMATTR Value 4.8k
SYMBOL njf 6976 -9712 R0
WINDOW 0 56 32 Invisible 2
WINDOW 3 56 72 Invisible 2
SYMATTR InstName J_A21
SYMATTR Value DR
SYMBOL res 7008 -9808 R0
WINDOW 0 56 32 Invisible 2
WINDOW 3 56 72 Invisible 2
SYMATTR InstName R34
SYMATTR Value 50k
SYMBOL njf 7152 -9776 R0
WINDOW 0 56 32 Invisible 2
WINDOW 3 56 72 Invisible 2
SYMATTR InstName J_A22
SYMATTR Value DR
SYMBOL res 7184 -9696 R0
WINDOW 0 37 24 Invisible 2
WINDOW 3 -30 25 Invisible 2
SYMATTR InstName R35
SYMATTR Value 1k
SYMBOL res 7216 -9616 R90
WINDOW 0 59 66 Invisible 2
WINDOW 3 34 13 Invisible 2
SYMATTR InstName R36
SYMATTR Value 4.5k
SYMBOL njf 6976 -9456 R0
WINDOW 0 56 32 Invisible 2
WINDOW 3 56 72 Invisible 2
SYMATTR InstName J_A23
SYMATTR Value DR
SYMBOL res 7008 -9552 R0
WINDOW 0 56 32 Invisible 2
WINDOW 3 56 72 Invisible 2
SYMATTR InstName R37
SYMATTR Value 50k
SYMBOL njf 7152 -9520 R0
WINDOW 0 56 32 Invisible 2
WINDOW 3 56 72 Invisible 2
SYMATTR InstName J_A24
SYMATTR Value DR
SYMBOL res 7184 -9440 R0
WINDOW 0 37 24 Invisible 2
WINDOW 3 -30 25 Invisible 2
SYMATTR InstName R38
SYMATTR Value 1k
SYMBOL res 7216 -9360 R90
WINDOW 0 59 66 Invisible 2
WINDOW 3 34 13 Invisible 2
SYMATTR InstName R39
SYMATTR Value 4.5k
SYMBOL njf 6976 -9184 R0
WINDOW 0 56 32 Invisible 2
WINDOW 3 56 72 Invisible 2
SYMATTR InstName J_A25
SYMATTR Value DR
SYMBOL res 7008 -9280 R0
WINDOW 0 56 32 Invisible 2
WINDOW 3 56 72 Invisible 2
SYMATTR InstName R40
SYMATTR Value 50k
SYMBOL njf 7152 -9248 R0
WINDOW 0 56 32 Invisible 2
WINDOW 3 56 72 Invisible 2
SYMATTR InstName J_A26
SYMATTR Value DR
SYMBOL res 7184 -9168 R0
WINDOW 0 37 24 Invisible 2
WINDOW 3 -30 25 Invisible 2
SYMATTR InstName R41
SYMATTR Value 1k
SYMBOL res 7216 -9088 R90
WINDOW 0 59 66 Invisible 2
WINDOW 3 34 13 Invisible 2
SYMATTR InstName R42
SYMATTR Value 4.5k
SYMBOL njf 6976 -8928 R0
WINDOW 0 56 32 Invisible 2
WINDOW 3 56 72 Invisible 2
SYMATTR InstName J_A27
SYMATTR Value DR
SYMBOL res 7008 -9024 R0
WINDOW 0 56 32 Invisible 2
WINDOW 3 56 72 Invisible 2
SYMATTR InstName R43
SYMATTR Value 50k
SYMBOL njf 7152 -8992 R0
WINDOW 0 56 32 Invisible 2
WINDOW 3 56 72 Invisible 2
SYMATTR InstName J_A28
SYMATTR Value DR
SYMBOL res 7184 -8912 R0
WINDOW 0 37 24 Invisible 2
WINDOW 3 -30 25 Invisible 2
SYMATTR InstName R44
SYMATTR Value 1k
SYMBOL res 7216 -8832 R90
WINDOW 0 59 66 Invisible 2
WINDOW 3 34 13 Invisible 2
SYMATTR InstName R45
SYMATTR Value 4.5k
SYMBOL res 7488 -9888 R0
WINDOW 0 -35 57 Invisible 2
WINDOW 3 34 56 Invisible 2
SYMATTR InstName R46
SYMATTR Value 100k
SYMBOL njf 7632 -9840 R0
WINDOW 0 56 32 Invisible 2
WINDOW 3 56 72 Invisible 2
SYMATTR InstName J_F5
SYMATTR Value DR
SYMBOL res 7664 -9760 R0
WINDOW 0 -24 60 Invisible 2
WINDOW 3 34 58 Invisible 2
SYMATTR InstName R47
SYMATTR Value 1k
SYMBOL res 7664 -9680 R0
WINDOW 0 -22 62 Invisible 2
WINDOW 3 37 62 Invisible 2
SYMATTR InstName R48
SYMATTR Value 4.8k
SYMBOL njf 7728 -9728 R0
WINDOW 0 56 32 Invisible 2
WINDOW 3 56 72 Invisible 2
SYMATTR InstName J_A29
SYMATTR Value DR
SYMBOL res 7760 -9824 R0
WINDOW 0 56 32 Invisible 2
WINDOW 3 56 72 Invisible 2
SYMATTR InstName R49
SYMATTR Value 50k
SYMBOL njf 7904 -9792 R0
WINDOW 0 56 32 Invisible 2
WINDOW 3 56 72 Invisible 2
SYMATTR InstName J_A30
SYMATTR Value DR
SYMBOL res 7936 -9712 R0
WINDOW 0 37 24 Invisible 2
WINDOW 3 -30 25 Invisible 2
SYMATTR InstName R50
SYMATTR Value 1k
SYMBOL res 7968 -9632 R90
WINDOW 0 59 66 Invisible 2
WINDOW 3 34 13 Invisible 2
SYMATTR InstName R51
SYMATTR Value 4.5k
SYMBOL njf 7728 -9472 R0
WINDOW 0 56 32 Invisible 2
WINDOW 3 56 72 Invisible 2
SYMATTR InstName J_A31
SYMATTR Value DR
SYMBOL res 7760 -9568 R0
WINDOW 0 56 32 Invisible 2
WINDOW 3 56 72 Invisible 2
SYMATTR InstName R52
SYMATTR Value 50k
SYMBOL njf 7904 -9536 R0
WINDOW 0 56 32 Invisible 2
WINDOW 3 56 72 Invisible 2
SYMATTR InstName J_A32
SYMATTR Value DR
SYMBOL res 7936 -9456 R0
WINDOW 0 37 24 Invisible 2
WINDOW 3 -30 25 Invisible 2
SYMATTR InstName R53
SYMATTR Value 1k
SYMBOL res 7968 -9376 R90
WINDOW 0 59 66 Invisible 2
WINDOW 3 34 13 Invisible 2
SYMATTR InstName R54
SYMATTR Value 4.5k
SYMBOL njf 7728 -9200 R0
WINDOW 0 56 32 Invisible 2
WINDOW 3 56 72 Invisible 2
SYMATTR InstName J_A33
SYMATTR Value DR
SYMBOL res 7760 -9296 R0
WINDOW 0 56 32 Invisible 2
WINDOW 3 56 72 Invisible 2
SYMATTR InstName R55
SYMATTR Value 50k
SYMBOL njf 7904 -9264 R0
WINDOW 0 56 32 Invisible 2
WINDOW 3 56 72 Invisible 2
SYMATTR InstName J_A34
SYMATTR Value DR
SYMBOL res 7936 -9184 R0
WINDOW 0 37 24 Invisible 2
WINDOW 3 -30 25 Invisible 2
SYMATTR InstName R56
SYMATTR Value 1k
SYMBOL res 7968 -9104 R90
WINDOW 0 59 66 Invisible 2
WINDOW 3 34 13 Invisible 2
SYMATTR InstName R57
SYMATTR Value 4.5k
SYMBOL njf 7728 -8944 R0
WINDOW 0 56 32 Invisible 2
WINDOW 3 56 72 Invisible 2
SYMATTR InstName J_A35
SYMATTR Value DR
SYMBOL res 7760 -9040 R0
WINDOW 0 56 32 Invisible 2
WINDOW 3 56 72 Invisible 2
SYMATTR InstName R58
SYMATTR Value 50k
SYMBOL njf 7904 -9008 R0
WINDOW 0 56 32 Invisible 2
WINDOW 3 56 72 Invisible 2
SYMATTR InstName J_A36
SYMATTR Value DR
SYMBOL res 7936 -8928 R0
WINDOW 0 37 24 Invisible 2
WINDOW 3 -30 25 Invisible 2
SYMATTR InstName R59
SYMATTR Value 1k
SYMBOL res 7968 -8848 R90
WINDOW 0 59 66 Invisible 2
WINDOW 3 34 13 Invisible 2
SYMATTR InstName R60
SYMATTR Value 4.5k
TEXT 8552 -9448 Left 2 !.tran 0 1000us 1ps 0.01
TEXT 8736 -9968 Left 7 ;System Parameters
TEXT 8568 -9504 Left 2 !.model DR NJF(Beta=0.135m Betatce=-0.5 Vto=-3.45 Vtotc=-2.5m Lambda=0.005 Is=205.2f Xti=3 Isr=1988f Nr=4 Alpha=20.98u N=3 Rd=1 Rs=1 Cgd=16.9p Cgs=16.9p Fc=0.5 Vk=123.7 M=407m Pb=1 Kf=37860f Af=1 Mfg=Linear_Systems)
TEXT 8560 -9472 Left 2 !.options NoOpIter
TEXT 9904 -9960 Left 7 ;ROM Inputs
TEXT 6328 -10016 Left 7 ;BUS
TEXT 8192 -9984 Left 7 ;Bus In

The netlist it stands for:
* controls.asc
V4 VDD 0 24
V5 VSS 0 -20
V7 High 0 PULSE(-3.6 -800m 11u 1ns 1ns 50 50 1)
V10 Low 0 PULSE(-800m -3.6 0 1n 1n 50 50 1)
V3 CLK 0 PULSE(-3.6 -800m 10u 1ns 1ns 5us 10us 10000000000000)
V_D1 IR1_3_In 0 PWL file=ir1_3_in.pwl
V_D5 IR1_2_In 0 PWL file=ir1_2_in.pwl
V_D2 IR1_1_In 0 PWL file=ir1_1_in.pwl
V_D6 IR1_0_In 0 PWL file=ir1_0_in.pwl
V_D3 IR2_3_In 0 PWL file=ir2_3_in.pwl
V_D4 IR2_2_In 0 PWL file=ir2_2_in.pwl
V_D7 IR2_1_In 0 PWL file=ir2_1_in.pwl
V_D8 IR2_0_In 0 PWL file=ir2_0_in.pwl
V_D9 IR3_3_In 0 PWL file=ir3_3_in.pwl
V_D10 IR3_2_In 0 PWL file=ir3_2_in.pwl
V_D11 IR3_1_In 0 PWL file=ir3_1_in.pwl
V_D12 IR3_0_In 0 PWL file=ir3_0_in.pwl
V_D13 IR4_3_In 0 PWL file=ir4_3_in.pwl
V_D14 IR4_2_In 0 PWL file=ir4_2_in.pwl
V_D15 IR4_1_In 0 PWL file=ir4_1_in.pwl
V_D16 IR4_0_In 0 PWL file=ir4_0_in.pwl
J_A1 Acc_Load Startup_Pulse 0 DR
J_A2 Temp_Load Startup_Pulse 0 DR
J_A3 CF_Clear Startup_Pulse 0 DR
J_A4 Subtract_Reset Startup_Pulse 0 DR
J_A69 Subtract_Reset Startup_Pulse 0 DR
J_A70 AssertingBus Startup_Pulse 0 DR
J_B1 Shift_Loading Startup_Pulse 0 DR
J_B2 Shift_Reset Startup_Pulse 0 DR
J_A71 IndexReg_Load Startup_Pulse 0 DR
J_A72 PC3_Bus_Load Startup_Pulse 0 DR
J_A73 PC2_Bus_Load Startup_Pulse 0 DR
J_A74 PC1_Bus_Load Startup_Pulse 0 DR
V1 Startup_Pulse 0 PULSE(-3.6 -800m 6u 1ns 1ns 9us 10us 1)
V_D17 N001 0 PWL file=bus3in.pwl
V_D18 N002 0 PWL file=bus2in.pwl
V_D19 N003 0 PWL file=bus1in.pwl
V_D20 N004 0 PWL file=bus0in.pwl
J_A75 Bus3In N001 0 DR
J_A76 Bus2In N002 0 DR
J_A77 Bus1In N003 0 DR
J_A78 Bus0In N004 0 DR
R126 VDD Bus3In 100k
J_F1 VDD Bus3In P001 DR
R127 P001 N012 1k
R128 N012 VSS 4.8k
J_A86 N008 N012 0 DR
R129 VDD N008 50k
J_A87 VDD N008 P002 DR
R130 P002 Bus3 1k
R131 Bus3 VSS 4.5k
J_A88 N016 N012 0 DR
R132 VDD N016 50k
J_A89 VDD N016 P003 DR
R133 P003 Bus3 1k
R134 Bus3 VSS 4.5k
J_A90 N020 N012 0 DR
R135 VDD N020 50k
J_A91 VDD N020 P004 DR
R136 P004 Bus3 1k
R137 Bus3 VSS 4.5k
J_A92 N024 N012 0 DR
R138 VDD N024 50k
J_A93 VDD N024 P005 DR
R139 P005 Bus3 1k
R140 Bus3 VSS 4.5k
R16 VDD Bus2In 100k
J_F3 VDD Bus2In P006 DR
R17 P006 N010 1k
R18 N010 VSS 4.8k
J_A13 N006 N010 0 DR
R19 VDD N006 50k
J_A14 VDD N006 P007 DR
R20 P007 Bus2 1k
R21 Bus2 VSS 4.5k
J_A15 N014 N010 0 DR
R22 VDD N014 50k
J_A16 VDD N014 P008 DR
R23 P008 Bus2 1k
R24 Bus2 VSS 4.5k
J_A17 N018 N010 0 DR
R25 VDD N018 50k
J_A18 VDD N018 P009 DR
R26 P009 Bus2 1k
R27 Bus2 VSS 4.5k
J_A19 N022 N010 0 DR
R28 VDD N022 50k
J_A20 VDD N022 P010 DR
R29 P010 Bus2 1k
R30 Bus2 VSS 4.5k
R31 VDD Bus1In 100k
J_F4 VDD Bus1In P011 DR
R32 P011 N011 1k
R33 N011 VSS 4.8k
J_A21 N007 N011 0 DR
R34 VDD N007 50k
J_A22 VDD N007 P012 DR
R35 P012 Bus1 1k
R36 Bus1 VSS 4.5k
J_A23 N015 N011 0 DR
R37 VDD N015 50k
J_A24 VDD N015 P013 DR
R38 P013 Bus1 1k
R39 Bus1 VSS 4.5k
J_A25 N019 N011 0 DR
R40 VDD N019 50k
J_A26 VDD N019 P014 DR
R41 P014 Bus1 1k
R42 Bus1 VSS 4.5k
J_A27 N023 N011 0 DR
R43 VDD N023 50k
J_A28 VDD N023 P015 DR
R44 P015 Bus1 1k
R45 Bus1 VSS 4.5k
R46 VDD Bus0In 100k
J_F5 VDD Bus0In P016 DR
R47 P016 N009 1k
R48 N009 VSS 4.8k
J_A29 N005 N009 0 DR
R49 VDD N005 50k
J_A30 VDD N005 P017 DR
R50 P017 Bus0 1k
R51 Bus0 VSS 4.5k
J_A31 N013 N009 0 DR
R52 VDD N013 50k
J_A32 VDD N013 P018 DR
R53 P018 Bus0 1k
R54 Bus0 VSS 4.5k
J_A33 N017 N009 0 DR
R55 VDD N017 50k
J_A34 VDD N017 P019 DR
R56 P019 Bus0 1k
R57 Bus0 VSS 4.5k
J_A35 N021 N009 0 DR
R58 VDD N021 50k
J_A36 VDD N021 P020 DR
R59 P020 Bus0 1k
R60 Bus0 VSS 4.5k
.model NJF NJF
.model PJF PJF
.lib standard.jft
.tran 0 1000us 1ps 0.01
* System Parameters
.model DR NJF(Beta=0.135m Betatce=-0.5 Vto=-3.45 Vtotc=-2.5m Lambda=0.005 Is=205.2f Xti=3 Isr=1988f Nr=4 Alpha=20.98u N=3 Rd=1 Rs=1 Cgd=16.9p Cgs=16.9p Fc=0.5 Vk=123.7 M=407m Pb=1 Kf=37860f Af=1 Mfg=Linear_Systems)
.options NoOpIter
* ROM Inputs
* BUS
* Bus In
.backanno
.end